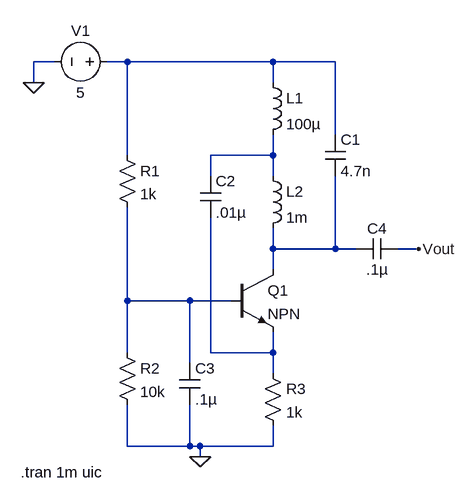
[diagram p0: schematic lc_osc.asc]
lc_osc.asc, the LTspice schematic file:
Version 4
SHEET 1 920 1184
WIRE 288 464 256 464
WIRE 400 464 368 464
WIRE 624 464 400 464
WIRE 720 464 624 464
WIRE 256 496 256 464
WIRE 624 496 624 464
WIRE 720 576 720 464
WIRE 400 608 400 464
WIRE 624 608 624 576
WIRE 624 608 528 608
WIRE 528 640 528 608
WIRE 624 640 624 608
WIRE 624 752 624 720
WIRE 720 752 720 640
WIRE 720 752 624 752
WIRE 752 752 720 752
WIRE 848 752 816 752
WIRE 624 784 624 752
WIRE 400 832 400 688
WIRE 496 832 400 832
WIRE 560 832 496 832
WIRE 400 912 400 832
WIRE 528 912 528 704
WIRE 624 912 624 880
WIRE 624 912 528 912
WIRE 496 928 496 832
WIRE 624 944 624 912
WIRE 400 1056 400 992
WIRE 496 1056 496 992
WIRE 496 1056 400 1056
WIRE 512 1056 496 1056
WIRE 624 1056 624 1024
WIRE 624 1056 512 1056
WIRE 512 1072 512 1056
FLAG 512 1072 0
FLAG 256 496 0
FLAG 848 752 Vout
SYMBOL voltage 384 464 R90
WINDOW 0 -32 56 VBottom 2
WINDOW 3 32 56 VTop 2
WINDOW 123 0 0 Left 0
WINDOW 39 0 0 Left 0
SYMATTR InstName V1
SYMATTR Value 5
SYMBOL ind 608 480 R0
SYMATTR InstName L1
SYMATTR Value 100µ
SYMBOL ind 608 624 R0
SYMATTR InstName L2
SYMATTR Value 1m
SYMBOL cap 704 576 R0
SYMATTR InstName C1
SYMATTR Value 4.7n
SYMBOL cap 512 640 R0
SYMATTR InstName C2
SYMATTR Value .01µ
SYMBOL npn 560 784 R0
SYMATTR InstName Q1
SYMBOL res 384 592 R0
SYMATTR InstName R1
SYMATTR Value 1k
SYMBOL res 608 928 R0
SYMATTR InstName R3
SYMATTR Value 1k
SYMBOL res 384 896 R0
SYMATTR InstName R2
SYMATTR Value 10k
SYMBOL cap 480 928 R0
SYMATTR InstName C3
SYMATTR Value .1µ
SYMBOL cap 816 736 R90
WINDOW 0 0 32 VBottom 2
WINDOW 3 32 32 VTop 2
SYMATTR InstName C4
SYMATTR Value .1µ
TEXT 236 1096 Left 2 !.tran 1m uic

The netlist it stands for:
* lc_osc.asc
V1 N001 0 5
L1 N001 N002 100µ
L2 N002 N003 1m
C1 N001 N003 4.7n
C2 N002 N005 .01µ
Q1 N003 N004 N005 0 NPN
R1 N001 N004 1k
R3 N005 0 1k
R2 N004 0 10k
C3 N004 0 .1µ
C4 Vout N003 .1µ
.model NPN NPN
.model PNP PNP
.lib standard.bjt
.tran 1m uic
.backanno
.end